# EAGLE design Module_I2C_Servo (EAGLE 9.6.2)
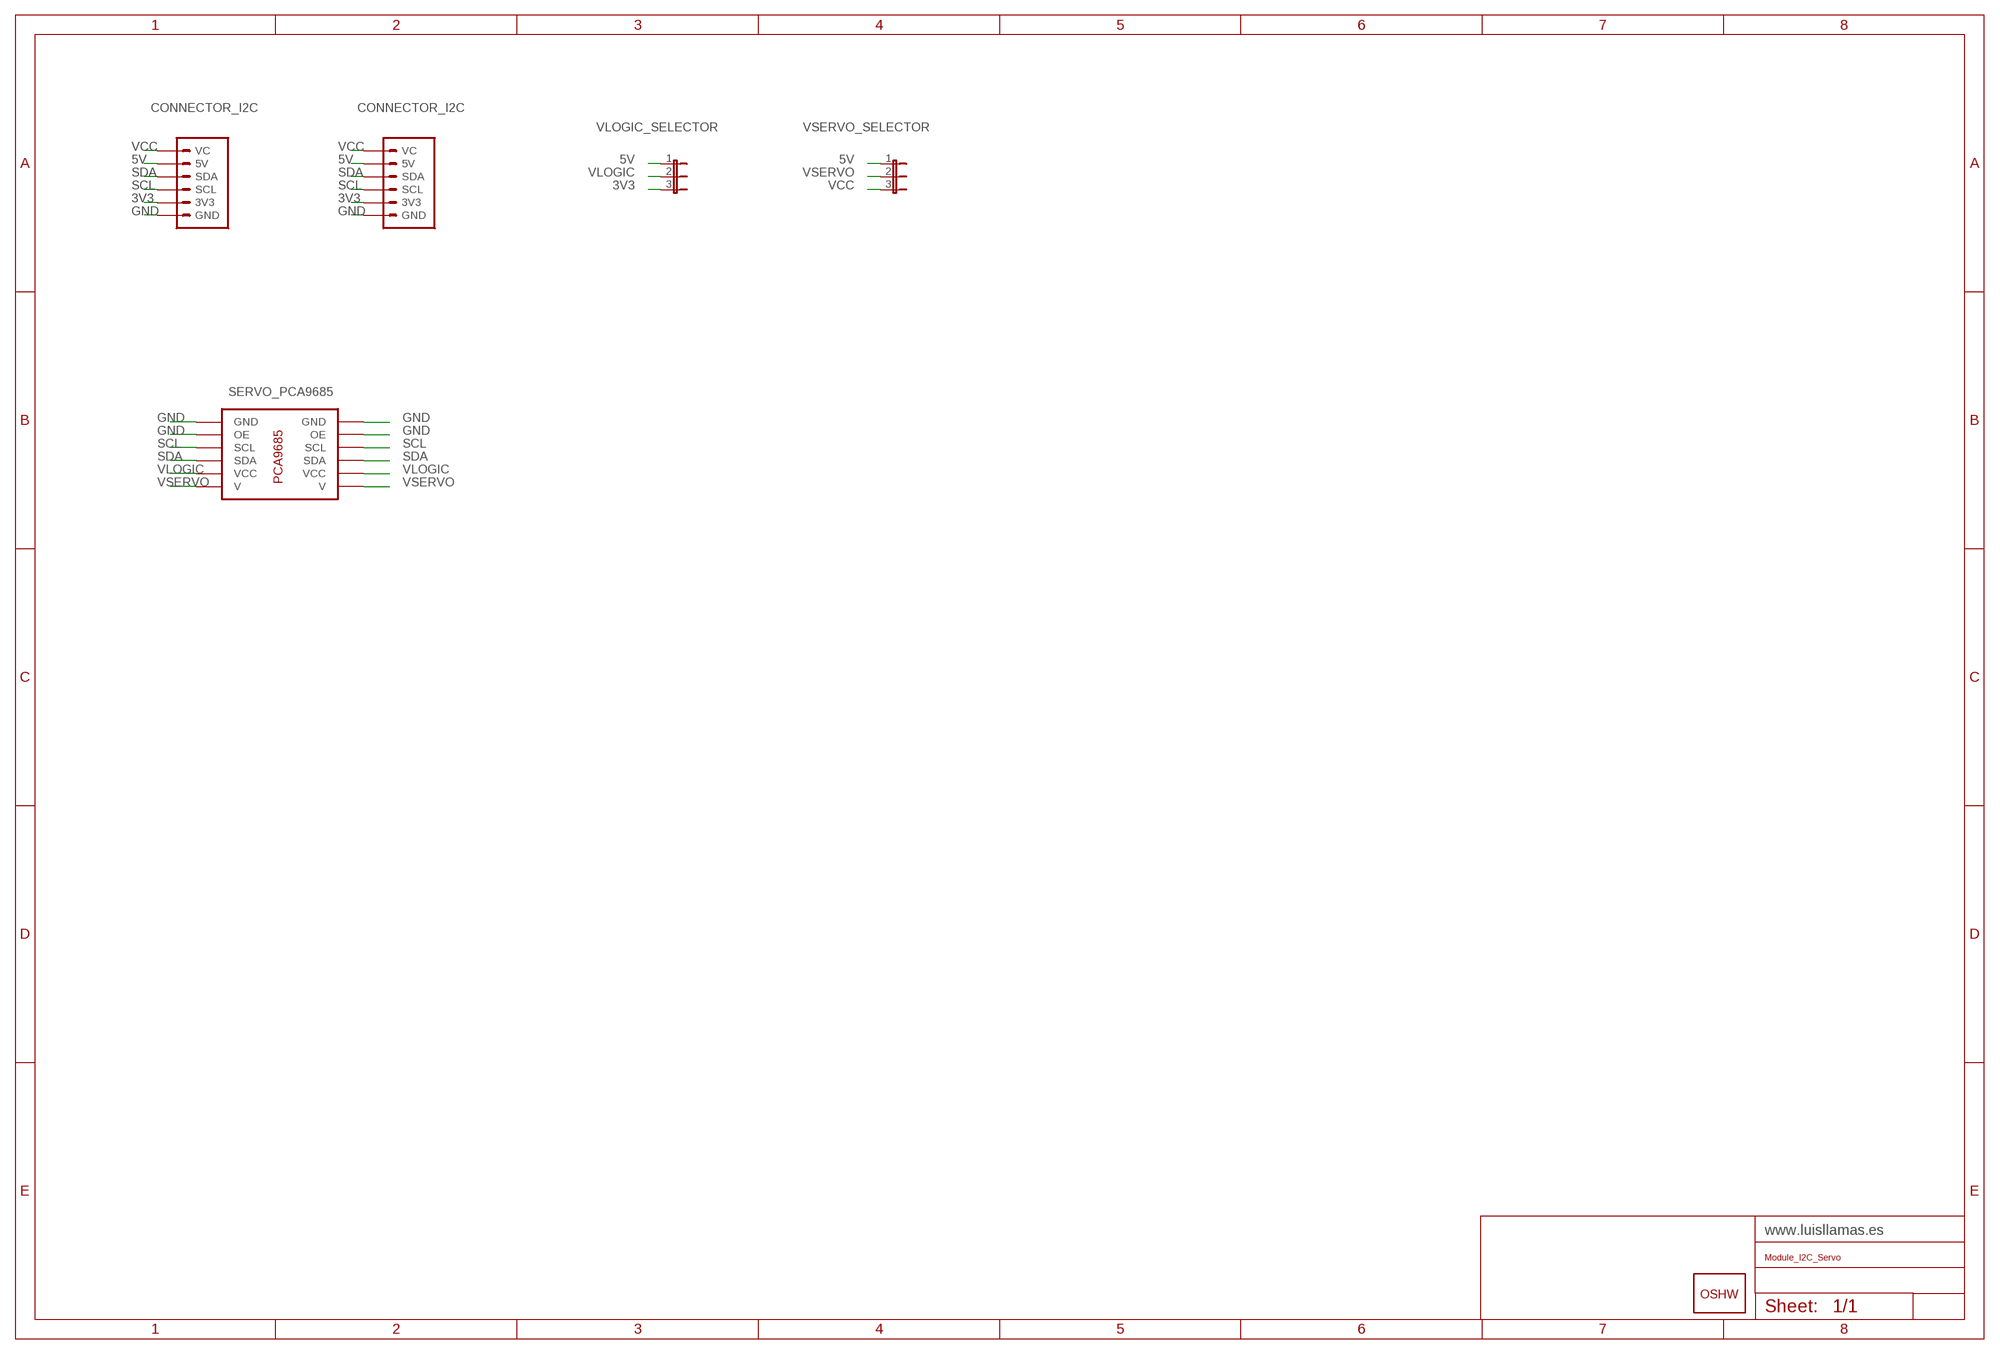
[diagram p0: schematic, sheet 1]

## Parts
GOLD_ORB_SM1  OSHWLOGO_GOLD_ORB_MED  [OSHW1]
U$2  SERVO_PCA9685  [SERVO_PCA9685]
U$3  CONNECTOR_I2C  [CONNECTOR_I2C]
U$4  CONNECTOR_I2C  [CONNECTOR_I2C]
VLOGIC_SELECTOR  JUMPER_3  [JUMPER_3]
VSERVO_SELECTOR  JUMPER_3  [JUMPER_3]

## Nets
3V3: U$3.3V3 U$4.3V3 VLOGIC_SELECTOR.3
5V: U$3.5V U$4.5V VLOGIC_SELECTOR.1 VSERVO_SELECTOR.1
GND: U$2.GND@0(GND) U$2.GND@1(GND) U$2.OE@0(OE) U$2.OE@1(OE) U$3.GND U$4.GND
SCL: U$2.SCL@0(SCL) U$2.SCL@1(SCL) U$3.SCL U$4.SCL
SDA: U$2.SDA@0(SDA) U$2.SDA@1(SDA) U$3.SDA U$4.SDA
VCC: U$3.VC U$4.VC VSERVO_SELECTOR.3
VLOGIC: U$2.VCC@0(VCC) U$2.VCC@1(VCC) VLOGIC_SELECTOR.2
VSERVO: U$2.VSERVO@0(V) U$2.VSERVO@1(V) VSERVO_SELECTOR.2

## Library data of the parts
GOLD_ORB_SM1 = LLL_Frames:OSHWLOGO: These are Open-Source Hardware logos.
U$2 = LLL_Modules:SERVO_PCA9685
U$3 U$4 = LLL_Connectors:CONNECTOR_I2C
VLOGIC_SELECTOR VSERVO_SELECTOR = LLL_Jumpers:JUMPER_3

## Net classes
0 default: clearance 0.205 mm

## Board
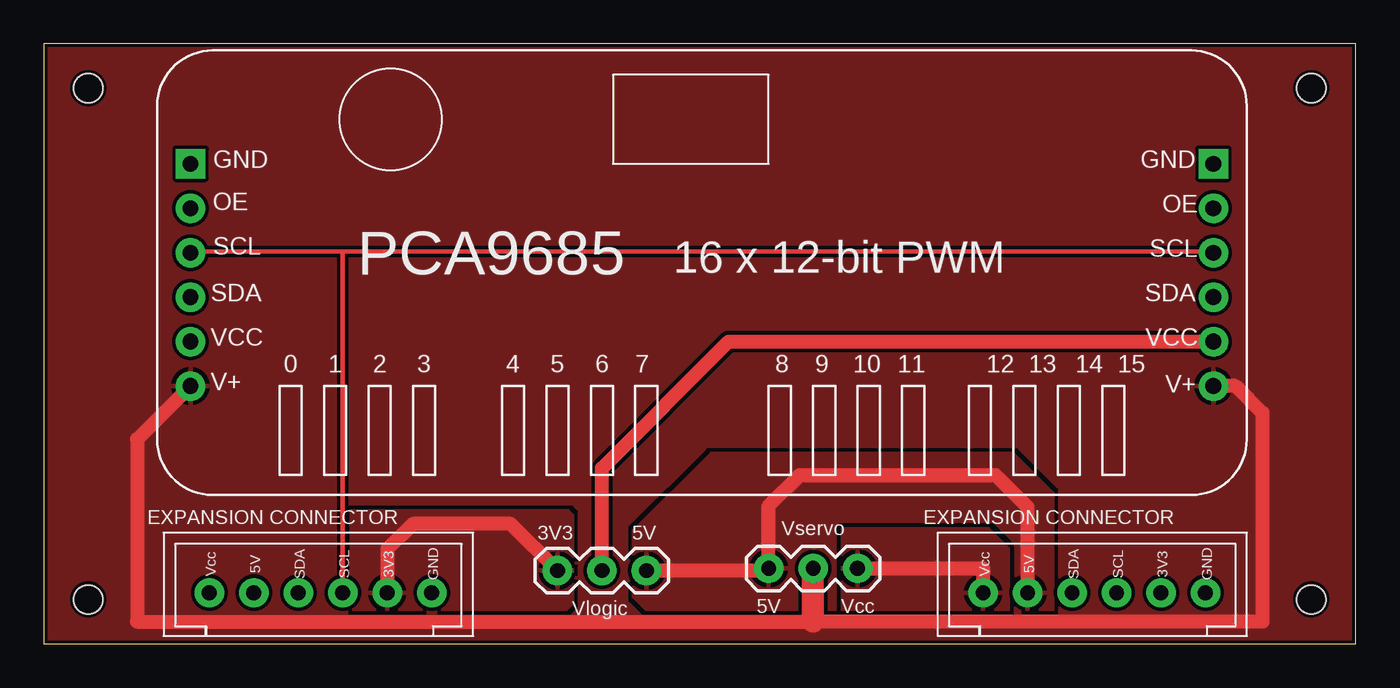
[diagram p1: board, top side]
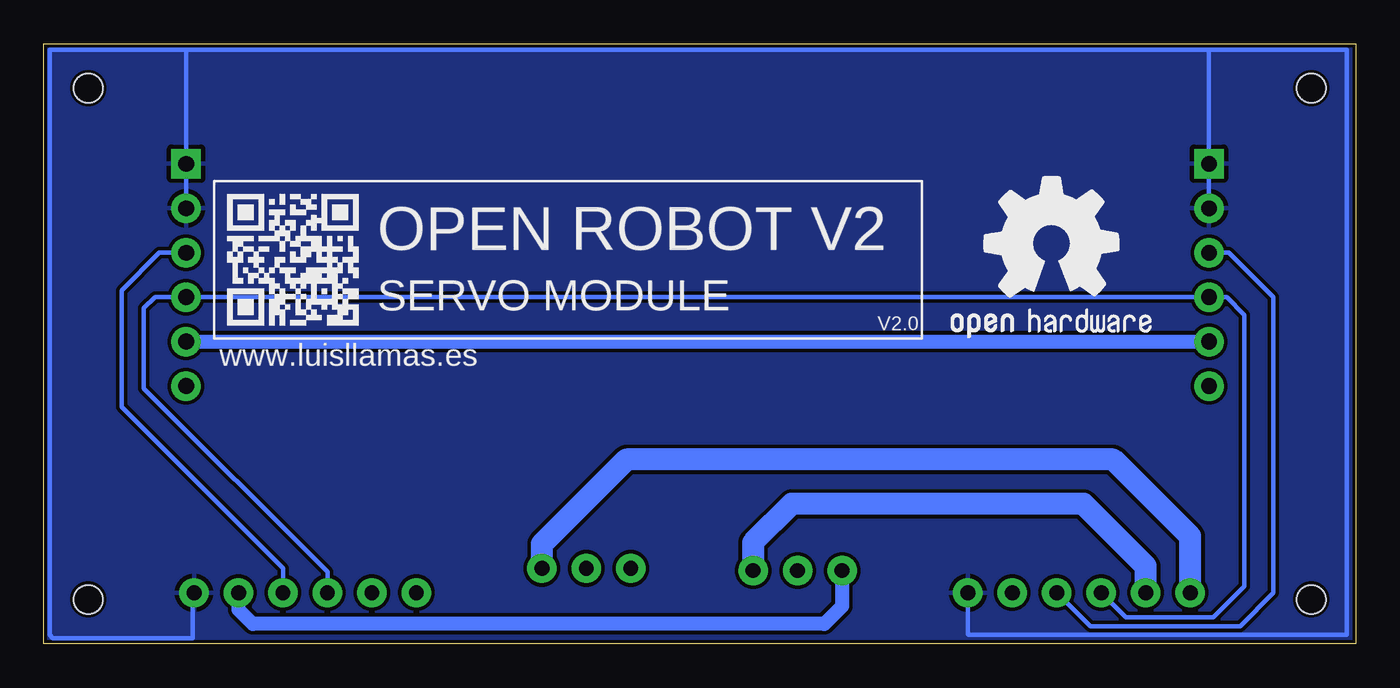
[diagram p2: board, bottom side, seen from below]

Size 74.93 x 34.29 mm. Coordinates in mm from the lower left corner, seen from the top.
Outline: 0,34.29 0,0 74.93,0 74.93,34.29 0,34.29
Copper layers (1*16): Top 0.035559375mm / dielectric 1.6mm / Bottom 0.035559375mm
Design rules "jlcpcb2layer": minimum track width 5mil, minimum drill 12mil, track to track 5mil, track to pad 5mil, pad to pad 5mil, via to via 5mil, smd to smd 5mil, copper to edge 8mil, drill to drill 6mil, minimum pad ring 5mil, minimum via ring 3mil, stop-mask expansion 2.5mil, vias tented up to drill 0mil, thermal gap 10mil
Holes 1.65 mm at 2.54,31.75 2.54,2.54 72.39,31.75 72.39,2.54

### Footprints (pad centres in the part's own frame; a part is rotated, then mirrored left to right if it is on the bottom)
SERVO_PCA9685 = drill 0.9 pad 1.676 square: GND@0 2.54,17.78; GND@1 60.96,17.78 | drill 0.9 pad 1.676: OE@0 2.54,15.24; OE@1 60.96,15.24; SCL@0 2.54,12.7; SCL@1 60.96,12.7; SDA@0 2.54,10.16; SDA@1 60.96,10.16; VCC@0 2.54,7.62; VCC@1 60.96,7.62; VSERVO@0 2.54,5.08; VSERVO@1 60.96,5.08
CONNECTOR_I2C = drill 0.85 pad 1.676: 3V3 0,3.866; 5V 0,-3.754; GND 0,6.406; SCL 0,1.326; SDA 0,-1.214; VC 0,-6.294
JUMPER_3 = drill 0.85 pad 1.676: 1 0,0; 2 2.54,0; 3 5.08,0

### Placement (x,y rotation side)
GOLD_ORB_SM1  23.75,15.75 0 bottom
U$2  5.84,9.65 0 top
U$3  15.75,2.92 270 top
U$4  59.94,2.92 270 top
VLOGIC_SELECTOR  34.42,4.19 180 top
VSERVO_SELECTOR  41.4,4.32 0 top

### Tracks (layer width: path | path; a pad name or v marks a point on that pad's centre or on a via)
3V3
  Top 0.813: VLOGIC_SELECTOR.3 26.67,6.86 21.08,6.86 19.61,5.39 U$3.3V3
  Bottom 0.813: VLOGIC_SELECTOR.3 29.34,2.16 30.35,1.14 62.99,1.14 63.81,1.96 U$4.3V3
  pour Top: 17.53,7.62 17.53,1.27 29.21,1.27 30.23,2.29 30.23,7.37 29.97,7.62
5V
  Top 0.813: U$4.5V 56.19,7.82 54.36,9.65 43.18,9.65 41.4,7.87 VSERVO_SELECTOR.1 41.27,4.19 VLOGIC_SELECTOR.1
  Bottom 1.27: U$3.5V 11.99,4.45 15.55,8 32.2,8 34.42,5.79 VLOGIC_SELECTOR.1
  pour Top: 33.66,6.48 33.66,2.67 34.54,1.78 45.21,1.78 45.21,6.73 45.47,6.99 54.23,6.99 55.5,5.71 55.5,1.78 57.66,1.78 57.66,8.64 55.37,10.92 38.1,10.92
GND
  Bottom 0.254: U$3.GND 22.15,0.56 22.1,0.51 0.51,0.51 0.51,33.96 8.38,33.96 | 8.38,33.96 66.8,33.96 | 66.8,33.96 74.6,33.96 74.6,0.51 74.42,0.33 66.42,0.33 66.42,2.85 U$4.GND | 8.38,33.96 U$2.GND@0 U$2.OE@0 | 66.8,33.96 U$2.GND@1 U$2.OE@1
  pour Bottom (rank 2): 0,0 0,34.29 74.93,34.29 74.93,0
SCL
  Top 0.254: U$3.SCL 17.07,22.42 | 17.07,22.42 66.6,22.42 66.67,22.35 U$2.SCL@1 | 17.07,22.42 8.45,22.42 U$2.SCL@0
  Bottom 0.254: U$2.SCL@1 68.33,22.35 70.48,20.19 70.48,13.53 61.27,4.32 U$4.SCL | U$2.SCL@0 7.24,22.35 4.7,19.81 4.7,2.92 6.6,1.02 15.17,1.02 U$3.SCL
SDA
  Bottom 0.254: U$3.SDA 13.14,1.52 8.13,1.52 6.35,3.3 6.35,18.8 7.37,19.81 U$2.SDA@0 U$2.SDA@1 68.58,19.81 69.22,19.18 69.22,14.61 58.73,4.12 U$4.SDA
VCC
  Top 0.813: VSERVO_SELECTOR.3 53.65,4.32 U$4.VC
  Bottom 1.27: VSERVO_SELECTOR.3 46.48,5.71 41.66,10.54 13.84,10.54 9.45,6.15 U$3.VC
  pour Top: 53.98,6.6 45.59,6.6 45.59,1.78 55.12,1.78 55.12,5.46
VLOGIC
  Top 0.813: VLOGIC_SELECTOR.2 31.88,10.03 39.12,17.27 U$2.VCC@1
  Bottom 0.813: U$2.VCC@1 U$2.VCC@0
VSERVO
  Top 0.813: U$2.VSERVO@0 5.33,11.68 5.33,1.27 43.94,1.27 69.6,1.27 69.6,13.21 68.07,14.73 U$2.VSERVO@1
  Top 1.27: 43.94,1.27 VSERVO_SELECTOR.2
  pour Top (rank 2): 0,0 0,34.29 74.93,34.29 74.93,0

### Text on the board
tPlace: EXPANSION CONNECTOR | Vservo | EXPANSION CONNECTOR | 3V3 | 5V | Vlogic | 5V | Vcc
bPlace: OPEN ROBOT V2 | SERVO MODULE | V2.0 | www.luisllamas.es